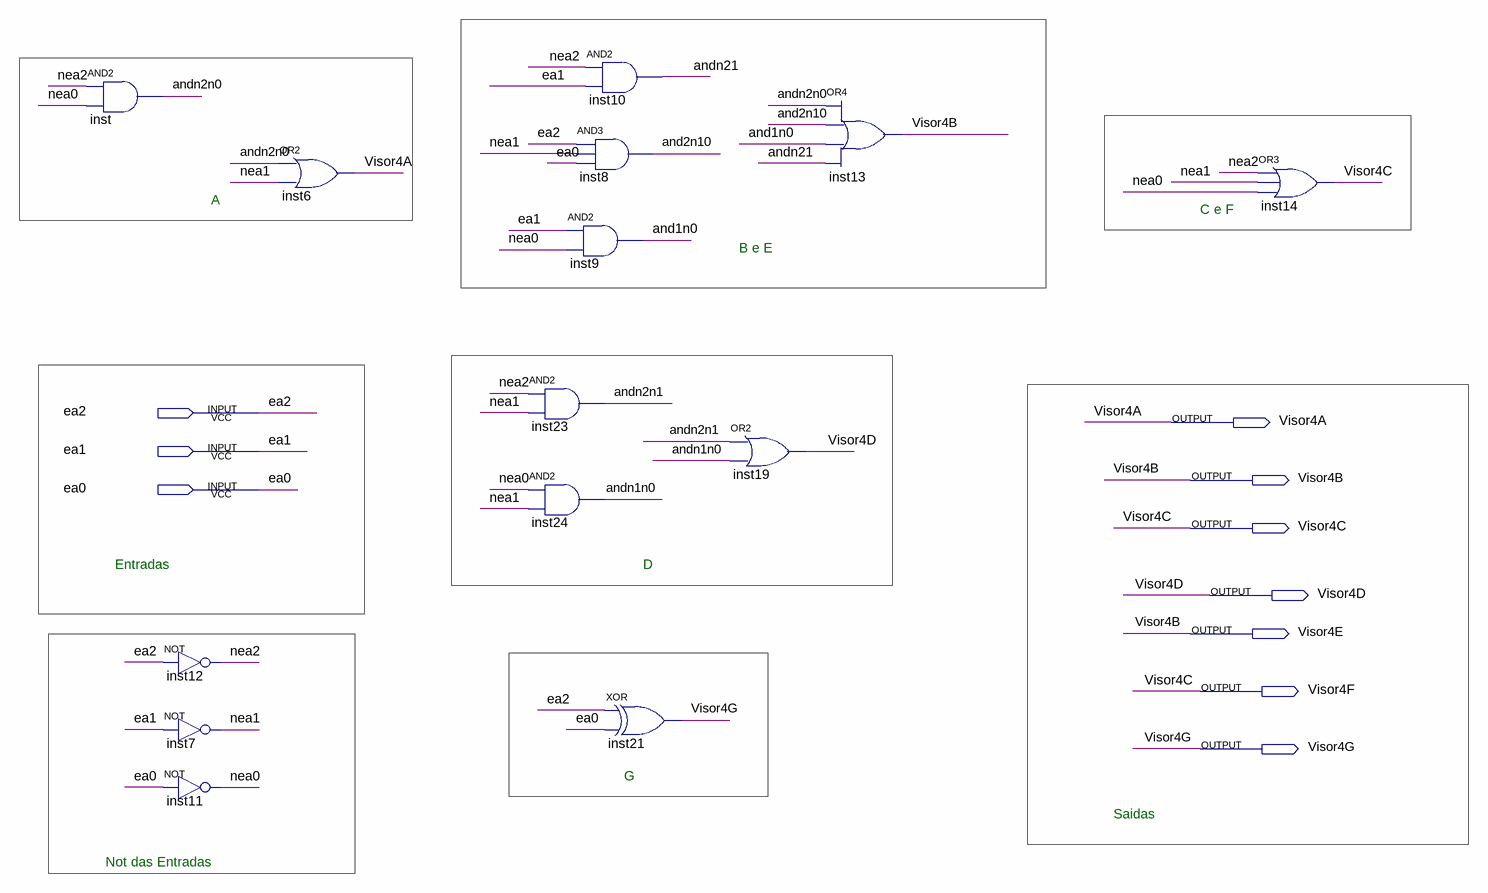
[diagram p0: schematic sheet]
// Quartus schematic Visor4.bdf as structural Verilog: 14 symbols, 10 pins
module Visor4 (
  input  ea2,
  input  ea1,
  input  ea0,
  output Visor4A,
  output Visor4B,
  output Visor4C,
  output Visor4D,
  output Visor4E,
  output Visor4F,
  output Visor4G
);

  wire and1n0, and2n10, andn1n0, andn2n0, andn2n1, andn21, nea0, nea1, nea2;

  and inst (andn2n0, nea2, nea0);
  not inst12 (nea2, ea2);
  not inst7 (nea1, ea1);
  not inst11 (nea0, ea0);
  or inst6 (Visor4A, andn2n0, nea1);
  and inst8 (and2n10, ea2, nea1, ea0);
  and inst9 (and1n0, ea1, nea0);
  and inst23 (andn2n1, nea2, nea1);
  and inst24 (andn1n0, nea0, nea1);
  and inst10 (andn21, nea2, ea1);
  xor inst21 (Visor4G, ea2, ea0);
  or inst19 (Visor4D, andn2n1, andn1n0);
  or inst13 (Visor4B, andn2n0, and2n10, and1n0, andn21);
  or inst14 (Visor4C, nea2, nea1, nea0);

  assign Visor4E = Visor4B;
  assign Visor4F = Visor4C;

  // Notes on the sheet:
  //   A
  //   C e F
  //   B e E
  //   Entradas
  //   D
  //   G
  //   Saidas
  //   Not das Entradas
endmodule
